# Altium schematic sheet LED0_7.SchDoc
size A4
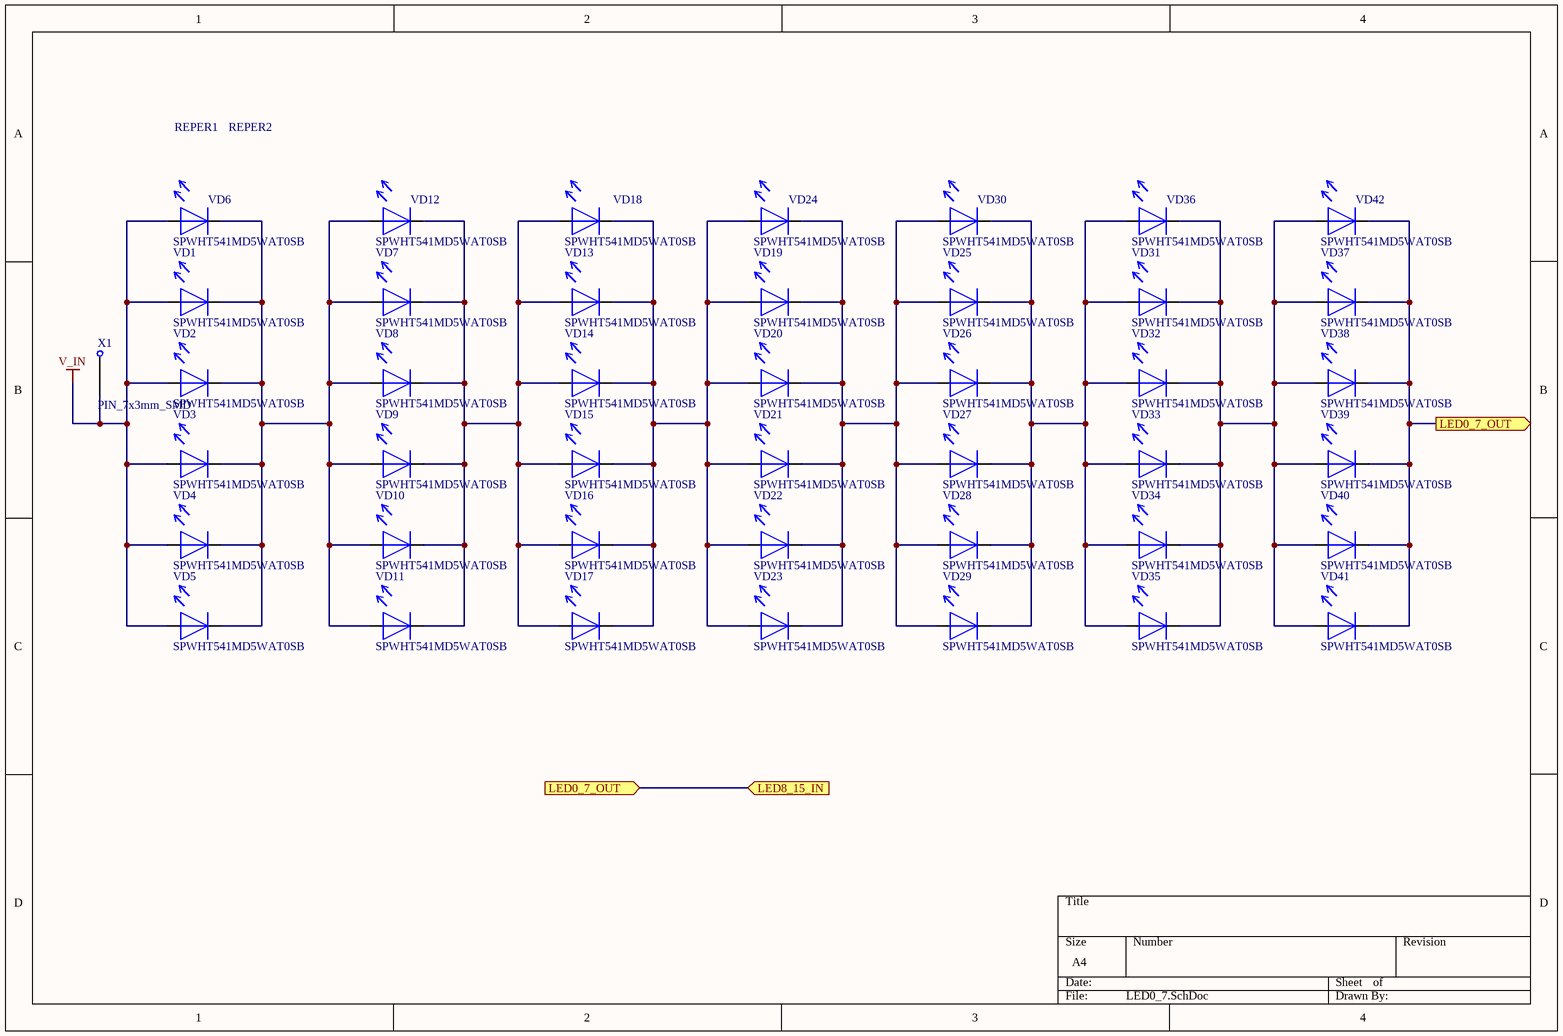
[diagram p0: LED0_7.SchDoc]

## Parts
REPER1  REPER1.2  [REPER1.2]  (value not drawn)
REPER2  REPER1.2  [REPER1.2]  (value not drawn)
VD1  SPWHT541MD5WAT0SB  [LED_SAMSUNG]
VD2  SPWHT541MD5WAT0SB  [LED_SAMSUNG]
VD3  SPWHT541MD5WAT0SB  [LED_SAMSUNG]
VD4  SPWHT541MD5WAT0SB  [LED_SAMSUNG]
VD5  SPWHT541MD5WAT0SB  [LED_SAMSUNG]
VD6  SPWHT541MD5WAT0SB  [LED_SAMSUNG]
VD7  SPWHT541MD5WAT0SB  [LED_SAMSUNG]
VD8  SPWHT541MD5WAT0SB  [LED_SAMSUNG]
VD9  SPWHT541MD5WAT0SB  [LED_SAMSUNG]
VD10  SPWHT541MD5WAT0SB  [LED_SAMSUNG]
VD11  SPWHT541MD5WAT0SB  [LED_SAMSUNG]
VD12  SPWHT541MD5WAT0SB  [LED_SAMSUNG]
VD13  SPWHT541MD5WAT0SB  [LED_SAMSUNG]
VD14  SPWHT541MD5WAT0SB  [LED_SAMSUNG]
VD15  SPWHT541MD5WAT0SB  [LED_SAMSUNG]
VD16  SPWHT541MD5WAT0SB  [LED_SAMSUNG]
VD17  SPWHT541MD5WAT0SB  [LED_SAMSUNG]
VD18  SPWHT541MD5WAT0SB  [LED_SAMSUNG]
VD19  SPWHT541MD5WAT0SB  [LED_SAMSUNG]
VD20  SPWHT541MD5WAT0SB  [LED_SAMSUNG]
VD21  SPWHT541MD5WAT0SB  [LED_SAMSUNG]
VD22  SPWHT541MD5WAT0SB  [LED_SAMSUNG]
VD23  SPWHT541MD5WAT0SB  [LED_SAMSUNG]
VD24  SPWHT541MD5WAT0SB  [LED_SAMSUNG]
VD25  SPWHT541MD5WAT0SB  [LED_SAMSUNG]
VD26  SPWHT541MD5WAT0SB  [LED_SAMSUNG]
VD27  SPWHT541MD5WAT0SB  [LED_SAMSUNG]
VD28  SPWHT541MD5WAT0SB  [LED_SAMSUNG]
VD29  SPWHT541MD5WAT0SB  [LED_SAMSUNG]
VD30  SPWHT541MD5WAT0SB  [LED_SAMSUNG]
VD31  SPWHT541MD5WAT0SB  [LED_SAMSUNG]
VD32  SPWHT541MD5WAT0SB  [LED_SAMSUNG]
VD33  SPWHT541MD5WAT0SB  [LED_SAMSUNG]
VD34  SPWHT541MD5WAT0SB  [LED_SAMSUNG]
VD35  SPWHT541MD5WAT0SB  [LED_SAMSUNG]
VD36  SPWHT541MD5WAT0SB  [LED_SAMSUNG]
VD37  SPWHT541MD5WAT0SB  [LED_SAMSUNG]
VD38  SPWHT541MD5WAT0SB  [LED_SAMSUNG]
VD39  SPWHT541MD5WAT0SB  [LED_SAMSUNG]
VD40  SPWHT541MD5WAT0SB  [LED_SAMSUNG]
VD41  SPWHT541MD5WAT0SB  [LED_SAMSUNG]
VD42  SPWHT541MD5WAT0SB  [LED_SAMSUNG]
X1  PIN_7x3mm_SMD  [PIN_7x3mm_SMD]

## Ports
LED0_7_OUT (in), LED0_7_OUT (out), LED8_15_IN (in)

## Nets
V_IN: VD1.1 VD2.1 VD3.1 VD4.1 VD5.1 VD6.1 X1.1
LED0_7_OUT: VD37.2 VD38.2 VD39.2 VD40.2 VD41.2 VD42.2 ; port LED0_7_OUT, port LED8_15_IN
NetVD1_2: VD1.2 VD2.2 VD3.2 VD4.2 VD5.2 VD6.2 VD7.1 VD8.1 VD9.1 VD10.1 VD11.1 VD12.1
NetVD7_2: VD7.2 VD8.2 VD9.2 VD10.2 VD11.2 VD12.2 VD13.1 VD14.1 VD15.1 VD16.1 VD17.1 VD18.1
NetVD13_2: VD13.2 VD14.2 VD15.2 VD16.2 VD17.2 VD18.2 VD19.1 VD20.1 VD21.1 VD22.1 VD23.1 VD24.1
NetVD19_2: VD19.2 VD20.2 VD21.2 VD22.2 VD23.2 VD24.2 VD25.1 VD26.1 VD27.1 VD28.1 VD29.1 VD30.1
NetVD25_2: VD25.2 VD26.2 VD27.2 VD28.2 VD29.2 VD30.2 VD31.1 VD32.1 VD33.1 VD34.1 VD35.1 VD36.1
NetVD31_2: VD31.2 VD32.2 VD33.2 VD34.2 VD35.2 VD36.2 VD37.1 VD38.1 VD39.1 VD40.1 VD41.1 VD42.1

Not connected (* = marked no-connect by the designer): REPER1 1; REPER2 1

## Library data of the parts
VD1-VD42 = LED SPWHT541MD5WAT0SB: Value: SPWHT541MD5WAT0SB
REPER1 REPER2 = REPER1.2: Value: *